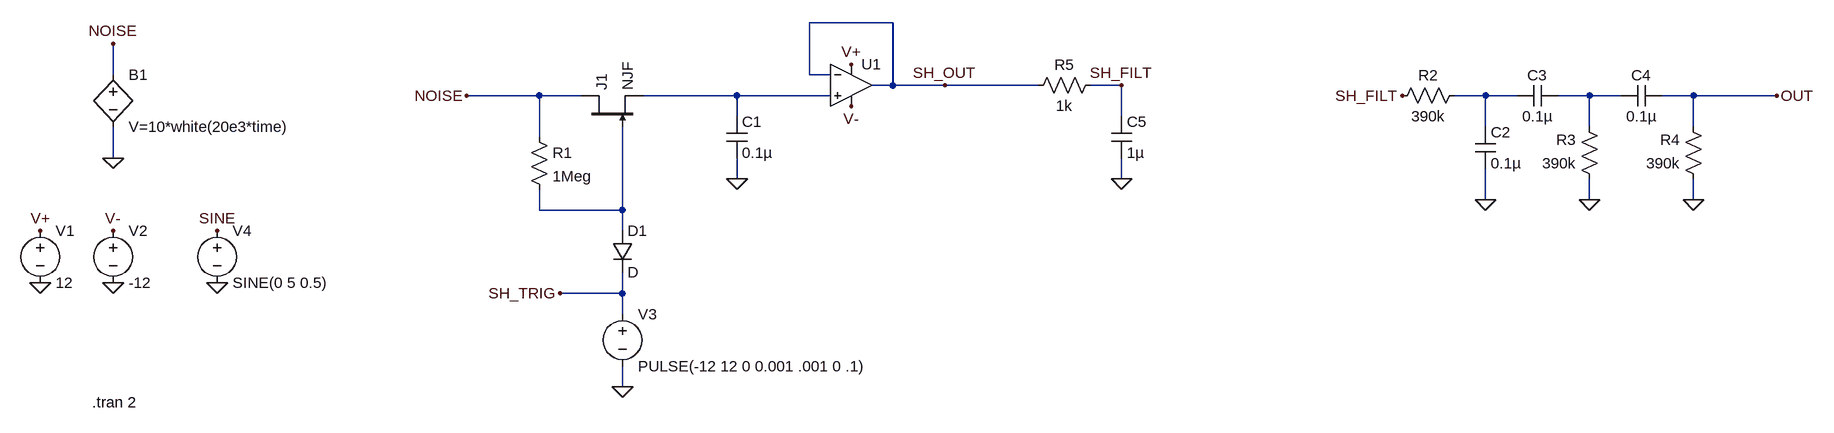
[diagram p0: schematic s&h.asc]
s&h.asc, the LTspice schematic file:
Version 4
SHEET 1 3848 680
WIRE 1216 48 1088 48
WIRE 16 128 16 80
WIRE 1088 128 1088 48
WIRE 1120 128 1088 128
WIRE 1216 144 1216 48
WIRE 1216 144 1184 144
WIRE 1296 144 1216 144
WIRE 1440 144 1296 144
WIRE 1568 144 1520 144
WIRE 672 160 560 160
WIRE 736 160 672 160
WIRE 976 160 832 160
WIRE 1120 160 976 160
WIRE 2128 160 2080 160
WIRE 2176 160 2128 160
WIRE 2288 160 2240 160
WIRE 2336 160 2288 160
WIRE 2448 160 2400 160
WIRE 2576 160 2448 160
WIRE 976 192 976 160
WIRE 1568 192 1568 144
WIRE 2128 208 2128 160
WIRE 2288 208 2288 160
WIRE 2448 208 2448 160
WIRE 672 224 672 160
WIRE 16 256 16 208
WIRE 976 288 976 256
WIRE 1568 288 1568 256
WIRE 2128 320 2128 272
WIRE 2288 320 2288 288
WIRE 2448 320 2448 288
WIRE 672 336 672 304
WIRE 800 336 800 208
WIRE 800 336 672 336
WIRE 800 368 800 336
WIRE 800 464 800 432
WIRE 800 464 704 464
WIRE 800 496 800 464
WIRE 800 608 800 576
FLAG 16 256 0
FLAG 16 80 NOISE
FLAG -96 448 0
FLAG 16 448 0
FLAG -96 368 V+
FLAG 16 368 V-
FLAG 1152 112 V+
FLAG 1152 176 V-
FLAG 976 288 0
FLAG 1296 144 SH_OUT
FLAG 800 608 0
FLAG 704 464 SH_TRIG
FLAG 2288 320 0
FLAG 2448 320 0
FLAG 2128 320 0
FLAG 2576 160 OUT
FLAG 1568 288 0
FLAG 176 448 0
FLAG 1568 144 SH_FILT
FLAG 176 368 SINE
FLAG 560 160 NOISE
FLAG 2000 160 SH_FILT
SYMBOL bv 16 112 R0
SYMATTR InstName B1
SYMATTR Value V=10*white(20e3*time)
SYMBOL njf 736 208 R270
SYMATTR InstName J1
SYMBOL res 656 208 R0
SYMATTR InstName R1
SYMATTR Value 1Meg
SYMBOL cap 960 192 R0
SYMATTR InstName C1
SYMATTR Value 0.1µ
SYMBOL OpAmps\\UniversalOpAmp2 1152 144 R0
SYMATTR InstName U1
SYMBOL voltage -96 352 R0
WINDOW 123 0 0 Left 0
WINDOW 39 0 0 Left 0
SYMATTR InstName V1
SYMATTR Value 12
SYMBOL voltage 16 352 R0
WINDOW 123 0 0 Left 0
WINDOW 39 0 0 Left 0
SYMATTR InstName V2
SYMATTR Value -12
SYMBOL diode 784 368 R0
SYMATTR InstName D1
SYMBOL voltage 800 480 R0
WINDOW 123 0 0 Left 0
WINDOW 39 0 0 Left 0
SYMATTR InstName V3
SYMATTR Value PULSE(-12 12 0 0.001 .001 0 .1)
SYMBOL res 2096 144 R90
WINDOW 0 0 56 VBottom 2
WINDOW 3 32 56 VTop 2
SYMATTR InstName R2
SYMATTR Value 390k
SYMBOL res 2304 304 R180
WINDOW 0 36 76 Left 2
WINDOW 3 36 40 Left 2
SYMATTR InstName R3
SYMATTR Value 390k
SYMBOL res 2464 304 R180
WINDOW 0 36 76 Left 2
WINDOW 3 36 40 Left 2
SYMATTR InstName R4
SYMATTR Value 390k
SYMBOL cap 2112 208 R0
SYMATTR InstName C2
SYMATTR Value 0.1µ
SYMBOL cap 2240 144 R90
WINDOW 0 0 32 VBottom 2
WINDOW 3 32 32 VTop 2
SYMATTR InstName C3
SYMATTR Value 0.1µ
SYMBOL cap 2400 144 R90
WINDOW 0 0 32 VBottom 2
WINDOW 3 32 32 VTop 2
SYMATTR InstName C4
SYMATTR Value 0.1µ
SYMBOL res 1536 128 R90
WINDOW 0 0 56 VBottom 2
WINDOW 3 32 56 VTop 2
SYMATTR InstName R5
SYMATTR Value 1k
SYMBOL cap 1552 192 R0
SYMATTR InstName C5
SYMATTR Value 1µ
SYMBOL voltage 176 352 R0
WINDOW 123 0 0 Left 0
WINDOW 39 0 0 Left 0
SYMATTR InstName V4
SYMATTR Value SINE(0 5 0.5)
TEXT -16 632 Left 2 !.tran 2

The netlist it stands for:
* s&h.asc
B1 NOISE 0 V=10*white(20e3*time)
J1 NOISE N004 N001 NJF
R1 NOISE N004 1Meg
C1 N001 0 0.1µ
XU1 N001 SH_OUT V+ V- SH_OUT level2 Avol=1Meg GBW=10Meg Slew=10Meg Ilimit=25m Rail=0 Vos=0 En=0 Enk=0 In=0 Ink=0 Rin=500Meg  ; pins In+ In- V+ V- OUT
V1 V+ 0 12
V2 V- 0 -12
D1 N004 SH_TRIG D
V3 SH_TRIG 0 PULSE(-12 12 0 0.001 .001 0 .1)
R2 N002 SH_FILT 390k
R3 0 N003 390k
R4 0 OUT 390k
C2 N002 0 0.1µ
C3 N003 N002 0.1µ
C4 OUT N003 0.1µ
R5 SH_FILT SH_OUT 1k
C5 SH_FILT 0 1µ
V4 SINE 0 SINE(0 5 0.5)
.model D D
.lib standard.dio
.model NJF NJF
.model PJF PJF
.lib standard.jft
.tran 2
.lib UniversalOpAmp2.lib
.backanno
.end